# Altium schematic sheet STM8S最小系统+外设原理图.SchDoc
size A4
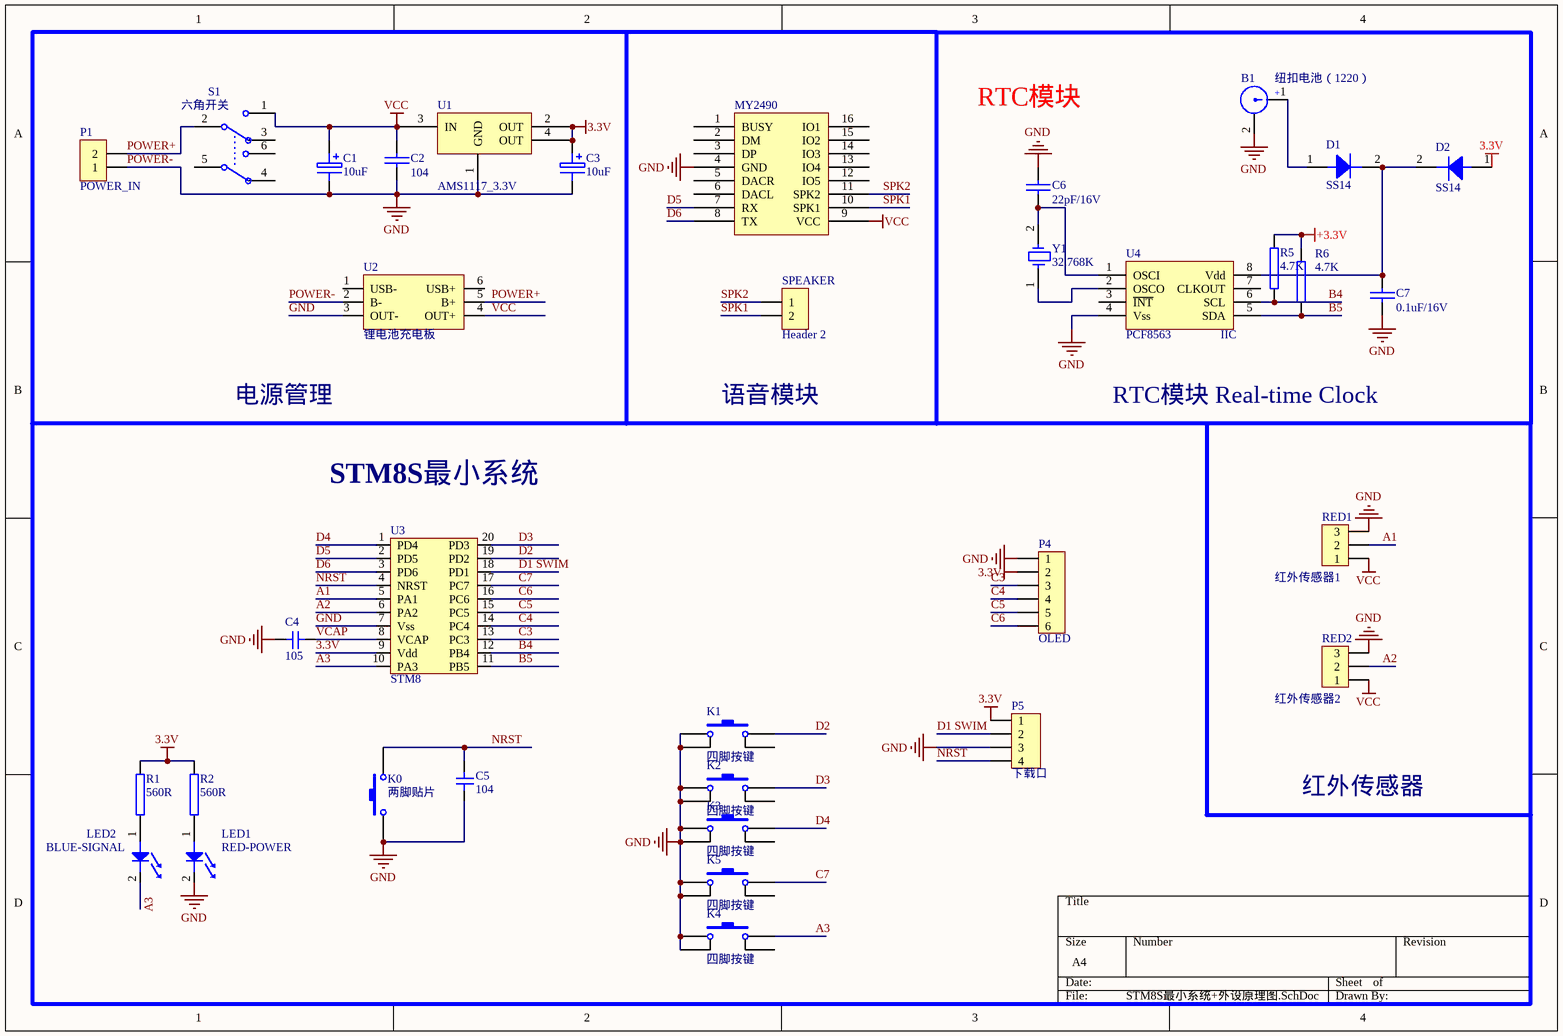
[diagram p0: STM8S最小系统+外设原理图.SchDoc]

## Parts
B1  纽扣电池（1220）  [CR1220]
C1  10uF  [Cap(10uF)]
C2  104  [0805C]
C3  10uF  [Cap(10uF)]
C4  105  [0805C]
C5  104  [0805C]
C6  22pF/16V  [0805C]
C7  0.1uF/16V  [0805C]
D1  SS14  [SS14]
D2  SS14  [SS14]
K0  两脚贴片  [贴片按键]
K1  四脚按键  [SW_PB4_DIP]
K2  四脚按键  [SW_PB4_DIP]
K3  四脚按键  [SW_PB4_DIP]
K4  四脚按键  [SW_PB4_DIP]
K5  四脚按键  [SW_PB4_DIP]
LED1  RED-POWER  [0805LED]
LED2  BLUE-SIGNAL  [0805LED]
MY2490  (no value)  [MY2490]
P1  POWER_IN  [Header 2]
P4  OLED  [Header 6]
P5  下载口  [Header 4]
R1  560R  [0805R]
R2  560R  [0805R]
R5  4.7K  [0805R]
R6  4.7K  [0805R]
RED1  红外传感器1  [Header 3]
RED2  红外传感器2  [Header 3]
S1  六角开关  [六角开关]
SPEAKER  Header 2  [Header 2]
U1  AMS1117_3.3V  [SOT-223]
U2  锂电池充电板  [锂电池充电板]
U3  STM8  [STM8_SOP20]
U4  PCF8563  [PCF8563]
Y1  32.768K  [XTAL]

## Blocks framed on the sheet
RTC模块: B1 C6 C7 D1 D2 R5 R6 U4 Y1

## Nets
3.3V: C3.1 D2.1 P4.2 P5.1 R1.2 R2.2 U1.2(OUT) U1.4(OUT) U3.9(Vdd)
+3.3V: R5.2 R6.2
GND: B1.2 C1.2 C2.2 C3.2 C4.1 C5.1 C6.1 C7.2 K0.1 K1.1 K1.4 K2.1 K2.4 K3.1 K3.4 K4.1 K4.4 K5.1 K5.4 LED1.2 MY2490.4(GND) P1.1 P4.1 P5.3 RED1.3 RED2.3 U1.1(GND) U2.2(B-) U2.3(OUT-) U3.7(Vss) U4.4(Vss)  [also labelled POWER-]
VCC: C1.1 C2.1 MY2490.9(VCC) RED1.1 RED2.1 S1.1 U1.3(IN) U2.4(OUT+)
A1: RED1.2 U3.5(PA1)
A2: RED2.2 U3.6(PA2)
A3: K4.2 LED2.2 U3.10(PA3)
B4: R5.1 U3.12(PB4) U4.6(SCL)
B5: R6.1 U3.11(PB5) U4.5(SDA)
C3: P4.3 U3.13(PC3)
C4: P4.4 U3.14(PC4)
C5: P4.5 U3.15(PC5)
C6: P4.6 U3.16(PC6)
C7: K5.2 U3.17(PC7)
D1 SWIM: P5.2 U3.18(PD1)
D2: K1.2 U3.19(PD2)
D3: K2.2 U3.20(PD3)
D4: K3.2 U3.1(PD4)
D5: MY2490.7(RX) U3.2(PD5)
D6: MY2490.8(TX) U3.3(PD6)
NRST: C5.2 K0.2 P5.4 U3.4(NRST)
POWER+: P1.2 S1.2 U2.5(B+)
SPK1: MY2490.10(SPK1) SPEAKER.2
SPK2: MY2490.11(SPK2) SPEAKER.1
VCAP: C4.2 U3.8(VCAP)
NetB1_1: B1.1(+) D1.1
NetC6_2: C6.2 U4.1(OSCI) Y1.2
NetC7_1: C7.1 D1.2 D2.2 U4.8(Vdd)
NetLED1_1: LED1.1 R2.1
NetLED2_1: LED2.1 R1.1
NetU4_2: U4.2(OSCO) Y1.1

Not connected (* = marked no-connect by the designer): K1 3; K2 3; K3 3; K4 3; K5 3; MY2490 1(BUSY) 2(DM) 3(DP) 5(DACR) 6(DACL) 12(IO5) 13(IO4) 14(IO3) 15(IO2) 16(IO1); S1 3 4 5 6; U2 1(USB-) 6(USB+); U4 3(~{INT}) 7(CLKOUT)

## Notes on the sheet
- (near U4) IIC
- 电源管理
- 语音模块
- RTC模块 Real-time Clock
- STM8S最小系统
- 红外传感器

## Library data of the parts
C1 C3 = Cap1
C2 C6 C7 = CAP: Capacitor
C4 C5 = C1
K0 = Key(两脚贴片)
K1-K5 = Key(四脚)
LED1 LED2 = LED
MY2490 = Component_2
P1 = Header 2
P4 = Header 6
P5 = Header 4
R1 R2 R5 R6 = R1
RED1 RED2 = Header 3
U1 = AMS1117-3.3V/5.0V
Y1 = XTAL